# Altium schematic sheet COVER PAGE.SchDoc: =GlobalProjectName
size A4; SheetNumber: 1; SheetTotal: 11; Designators: -; PageSize: A3
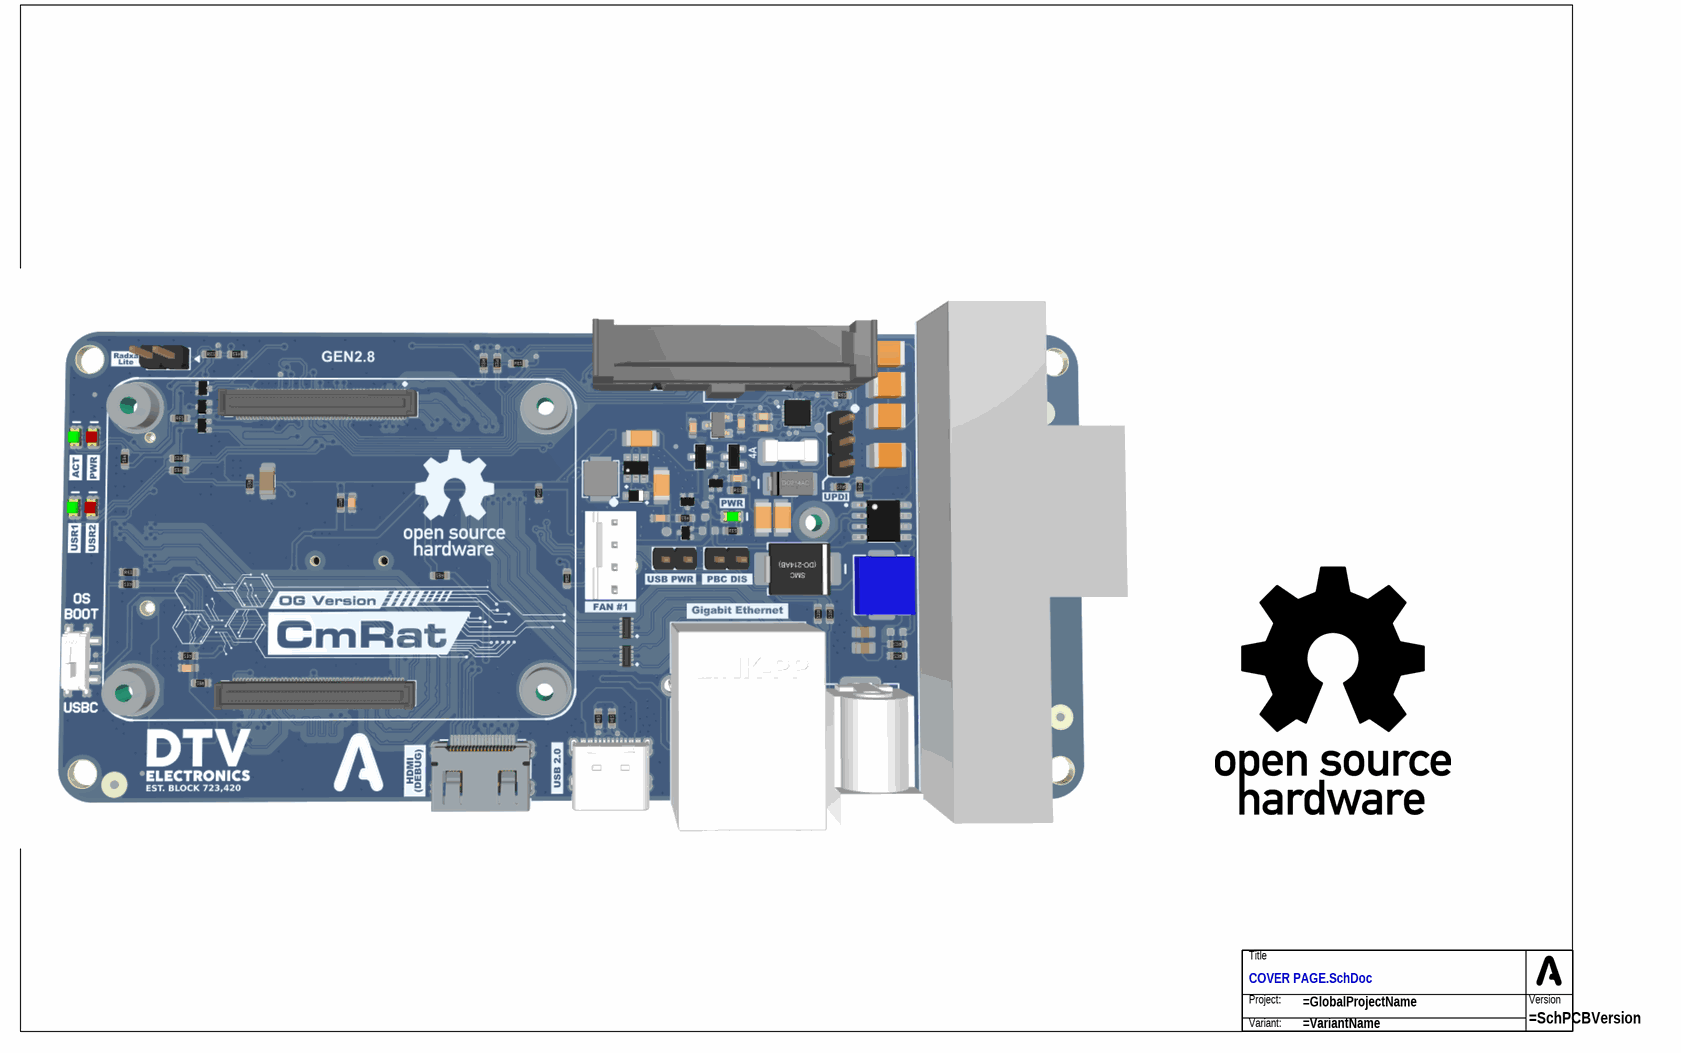
[diagram p0: COVER PAGE.SchDoc]

## Parts
TB1  (no value)  (no BOM)

## Notes on the sheet
- (in symbol SCH_TITLE_BLOCK_SIMPLE_NODATE) Title; Project:; Version; Variant:

## Library data of the parts
TB1 = SCH_TITLE_BLOCK_SIMPLE_NODATE